# EAGLE design Polysex board (EAGLE 7.6.0)
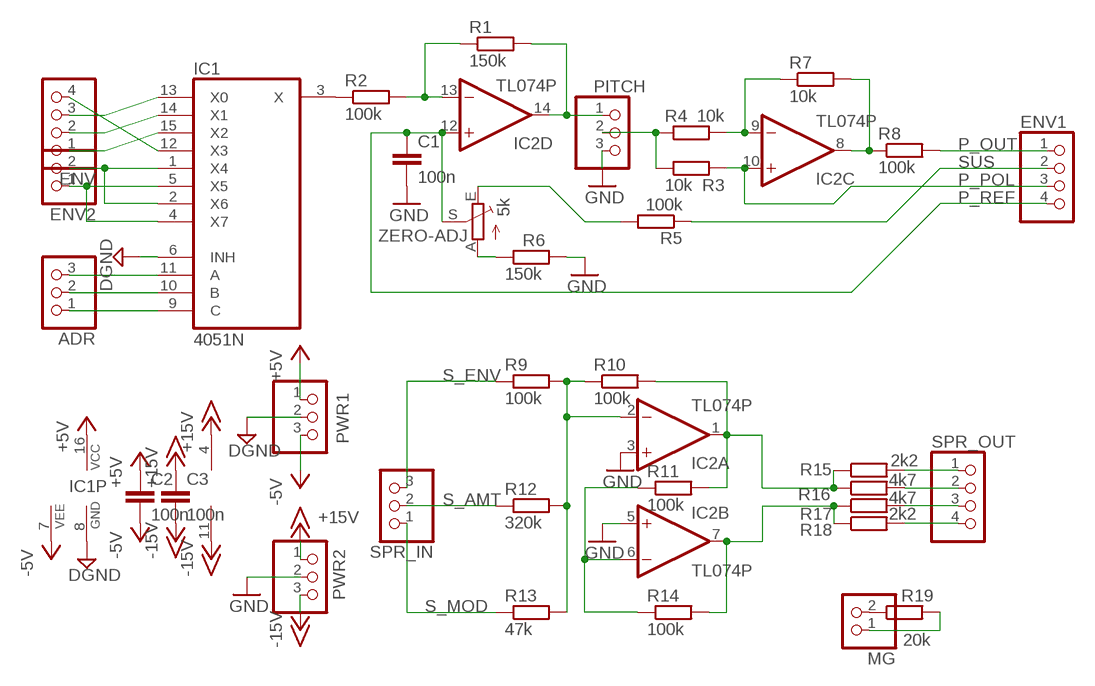
[diagram p0: schematic, sheet 1]

## Parts
ADR  PINHD-1X3  [1X03]
C1  100n  C-EU025-025X050  [C025-025X050]
C2  100n  C-EU025-025X050  [C025-025X050]
C3  100n  C-EU025-025X050  [C025-025X050]
ENV  PINHD-1X4  [1X04]
ENV1  PINHD-1X4  [1X04]
ENV2  PINHD-1X2  [1X02]
IC1  4051N  [DIL16]
IC2  TL074P  [DIL14]
MG  PINHD-1X2  [1X02]
PITCH  PINHD-1X3  [1X03]
PWR1  PINHD-1X3  [1X03]
PWR2  PINHD-1X3  [1X03]
R1  150k  R-EU_0204/7  [0204/7]
R2  100k  R-EU_0204/7  [0204/7]
R3  10k  R-EU_0204/7  [0204/7]
R4  10k  R-EU_0204/7  [0204/7]
R5  100k  R-EU_0204/7  [0204/7]
R6  150k  R-EU_0204/7  [0204/7]
R7  10k  R-EU_0204/7  [0204/7]
R8  100k  R-EU_0204/7  [0204/7]
R9  100k  R-EU_0204/7  [0204/7]
R10  100k  R-EU_0204/7  [0204/7]
R11  100k  R-EU_0204/7  [0204/7]
R12  320k  R-EU_0204/7  [0204/7]
R13  47k  R-EU_0204/7  [0204/7]
R14  100k  R-EU_0204/7  [0204/7]
R15  2k2  R-EU_0204/7  [0204/7]
R16  4k7  R-EU_0204/7  [0204/7]
R17  4k7  R-EU_0204/7  [0204/7]
R18  2k2  R-EU_0204/7  [0204/7]
R19  20k  R-EU_0204/7  [0204/7]
SPR_IN  PINHD-1X3  [1X03]
SPR_OUT  PINHD-1X4  [1X04]
ZERO-ADJ  5k  TRIM_EU-CA6V  [CA6V]

## Nets
+5V: C2.1 IC1.16(VCC) PWR1.1
+15V: C3.1 IC2.4(P:V+) PWR2.1
-5V: C2.2 IC1.7(VEE) PWR1.3
-15V: C3.2 IC2.11(P:V-) PWR2.3
DGND: IC1.6(INH) IC1.8(GND) PWR1.2
GND: C1.2 IC2.3(A:+IN) IC2.5(B:+IN) PITCH.3 PWR2.2 R6.2
N$1: IC1.3(X) R2.1
N$2: IC2.13(D:-IN) R1.1 R2.2
N$3: IC2.14(D:OUT) PITCH.1 R1.2
N$4: R5.2 ZERO-ADJ.E
N$5: MG.2 R19.1
N$6: IC2.9(C:-IN) R4.2 R7.1
N$7: MG.1 R19.2
N$8: PITCH.2 R3.1 R4.1
N$9: IC2.8(C:OUT) R7.2 R8.1
N$11: R6.1 ZERO-ADJ.A
N$12: IC2.2(A:-IN) R9.2 R10.1 R12.2 R13.2
N$13: IC2.1(A:OUT) R10.2 R11.2 R15.1 R16.1
N$16: IC2.6(B:-IN) R11.1 R14.1
N$19: IC2.7(B:OUT) R14.2 R17.1 R18.1
N$20: R15.2 SPR_OUT.1
N$21: R16.2 SPR_OUT.2
N$22: R17.2 SPR_OUT.3
N$23: R18.2 SPR_OUT.4
N$26: ADR.1 IC1.9(C)
N$27: ADR.2 IC1.10(B)
N$28: ADR.3 IC1.11(A)
P_OUT: ENV1.1 R8.2
P_POL: ENV1.3 IC2.10(C:+IN) R3.2
P_REF: C1.1 ENV1.4 IC2.12(D:+IN) ZERO-ADJ.S
S_AMT: R12.1 SPR_IN.2
S_ENV: R9.1 SPR_IN.3
S_MOD: R13.1 SPR_IN.1
SUS: ENV1.2 R5.1
X0: ENV.3 IC1.13(X0)
X1: ENV.2 IC1.14(X1)
X2: ENV.1 IC1.15(X2)
X3: ENV.4 IC1.12(X3)
X4: ENV2.2 IC1.1(X4) IC1.2(X6)
X5: ENV2.1 IC1.4(X7) IC1.5(X5)

## Library data of the parts
ADR PITCH PWR1 PWR2 SPR_IN = pinhead:PINHD-1X3: PIN HEADER
C1-C3 = rcl:C-EU: CAPACITOR, European symbol
ENV ENV1 SPR_OUT = pinhead:PINHD-1X4: PIN HEADER
ENV2 MG = pinhead:PINHD-1X2: PIN HEADER
IC1 = 40xx:4051: 8-channel ANALOG MULTIPLEXER
IC2 = linear:TL074: OP AMP
R1-R19 = rcl:R-EU_: RESISTOR, European symbol
ZERO-ADJ = pot:TRIM_EU-: POTENTIOMETER

## Board
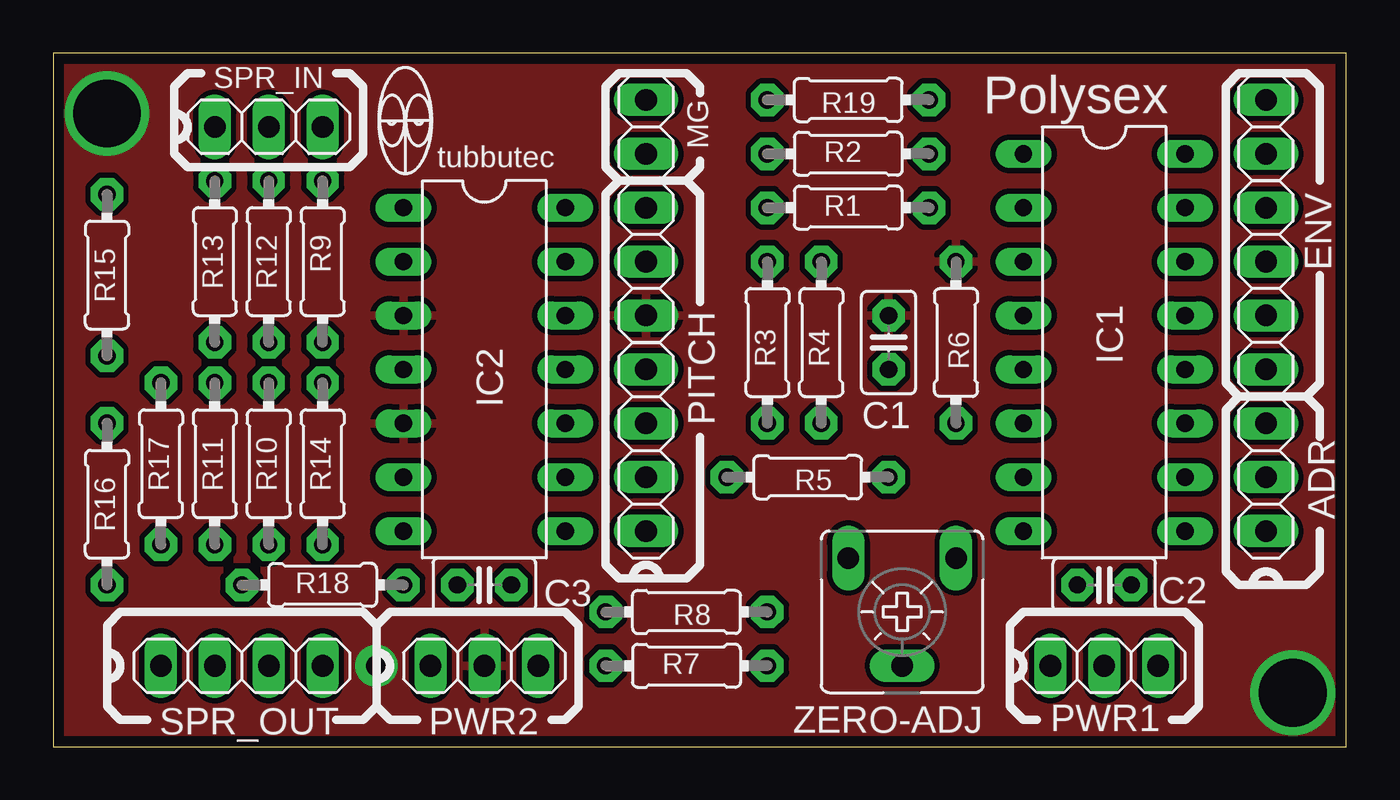
[diagram p1: board, top side]
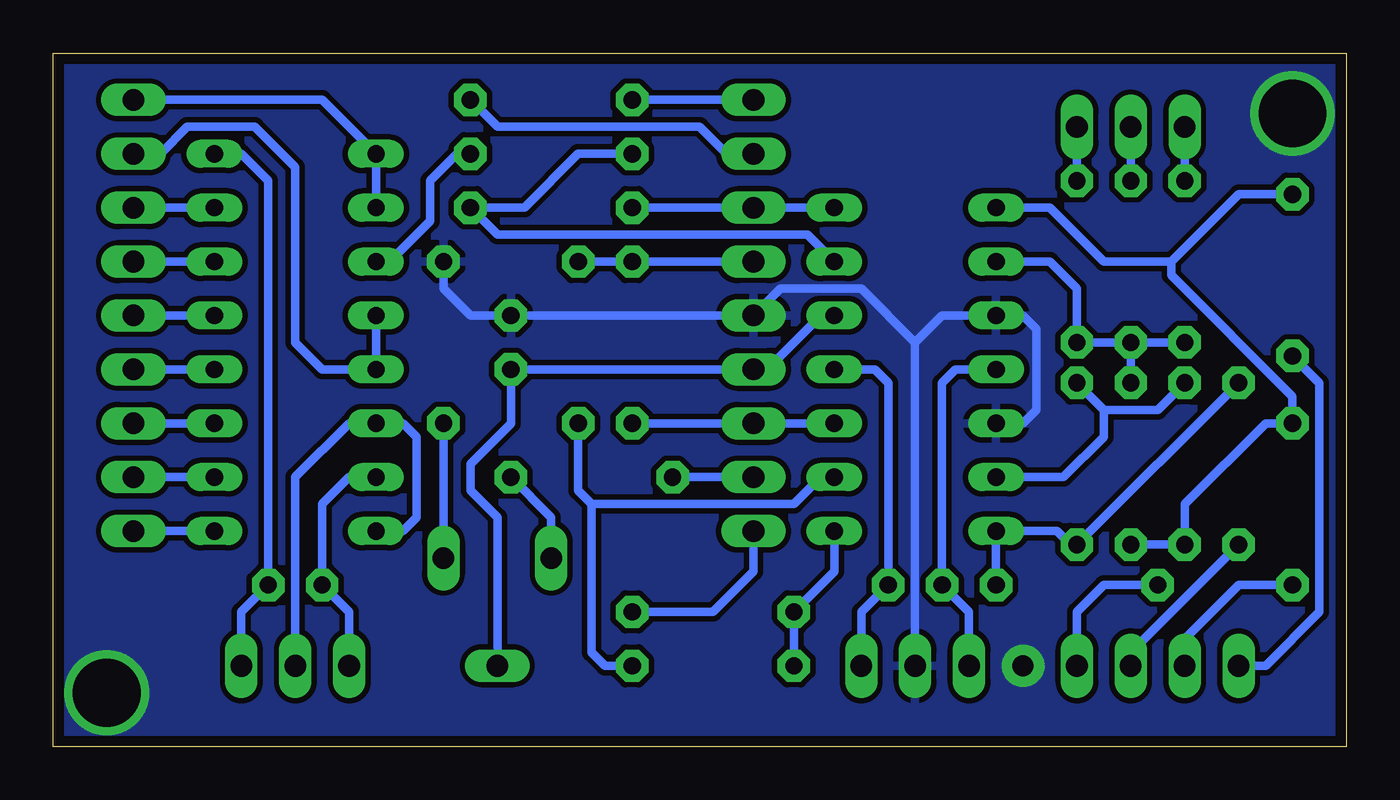
[diagram p2: board, bottom side, seen from below]

Size 60.94 x 32.69 mm. Coordinates in mm from the lower left corner, seen from the top.
Outline: 0,0 60.94,0 60.94,32.69 0,32.69 0,0
Copper layers (1*16): Top 0.035mm / dielectric 1.5mm / Bottom 0.035mm
Design rules "default *": minimum track width 10mil, minimum drill 12mil, track to track 10mil, track to pad 10mil, pad to pad 10mil, via to via 10mil, smd to smd 10mil, copper to edge 20mil, drill to drill 8mil, minimum pad ring 10mil, minimum via ring 10mil, stop-mask expansion 3mil, vias tented up to drill 0mil, thermal gap 10mil

### Footprints (pad centres in the part's own frame; a part is rotated, then mirrored left to right if it is on the bottom)
1X03 = drill 1.016 long: 1 -2.54,0; 2 0,0; 3 2.54,0
C025-025X050 = drill 0.813 pad 1.524 octagon: 1 -1.27,0; 2 1.27,0
1X04 = drill 1.016 long: 1 -3.81,0; 2 -1.27,0; 3 1.27,0; 4 3.81,0
1X02 = drill 1.016 long: 1 -1.27,0; 2 1.27,0
DIL16 = drill 0.813 long: 1 -8.89,-3.81; 2 -6.35,-3.81; 3 -3.81,-3.81; 4 -1.27,-3.81; 5 1.27,-3.81; 6 3.81,-3.81; 7 6.35,-3.81; 8 8.89,-3.81; 9 8.89,3.81; 10 6.35,3.81; 11 3.81,3.81; 12 1.27,3.81; 13 -1.27,3.81; 14 -3.81,3.81; 15 -6.35,3.81; 16 -8.89,3.81
DIL14 = drill 0.813 long: 1 -7.62,-3.81; 2 -5.08,-3.81; 3 -2.54,-3.81; 4 0,-3.81; 5 2.54,-3.81; 6 5.08,-3.81; 7 7.62,-3.81; 8 7.62,3.81; 9 5.08,3.81; 10 2.54,3.81; 11 0,3.81; 12 -2.54,3.81; 13 -5.08,3.81; 14 -7.62,3.81
0204/7 = drill 0.813 pad 1.524 octagon: 1 -3.81,0; 2 3.81,0
CA6V = drill 1.016 long: A -2.54,-2.54; E 2.54,-2.54; S 0,2.54

### Placement (x,y rotation side)
ADR  57.15,12.7 90 top
C1  39.37,19.05 90 top
C2  49.53,7.62 180 top
C3  20.32,7.62 0 top
ENV  57.15,21.59 270 top
ENV1  27.94,13.97 90 top
ENV2  57.15,29.21 90 top
IC1  49.53,19.05 270 top
IC2  20.32,17.78 270 top
MG  27.94,29.21 90 top
PITCH  27.94,22.86 270 top
PWR1  49.53,3.81 180 top
PWR2  20.32,3.81 0 top
R1  37.47,25.4 180 top
R2  37.47,27.94 180 top
R3  33.66,19.05 270 top
R4  36.2,19.05 270 top
R5  35.56,12.7 0 top
R6  42.55,19.05 90 top
R7  29.84,3.81 180 top
R8  29.84,6.35 0 top
R9  12.7,22.86 270 top
R10  10.16,13.34 270 top
R11  7.62,13.34 270 top
R12  10.16,22.86 270 top
R13  7.62,22.86 270 top
R14  12.7,13.34 270 top
R15  2.54,22.23 270 top
R16  2.54,11.43 270 top
R17  5.08,13.34 270 top
R18  12.7,7.62 180 top
R19  37.47,30.48 0 top
SPR_IN  10.16,29.21 0 top
SPR_OUT  8.89,3.81 0 top
ZERO-ADJ  40.01,6.35 180 top

### Tracks (layer width: path | path; a pad name or v marks a point on that pad's centre or on a via)
+5V
  Bottom 0.406: IC1.16 52.07,27.94 50.8,26.67 C2.1 52.07,6.35 PWR1.1
+15V
  Bottom 0.406: 17.78,2.54 PWR2.1 17.78,6.35 C3.1 19.05,17.14 18.41,17.78 IC2.4
-5V
  Bottom 0.406: IC1.7 46.99,12.7 48.26,11.43 C2.2 46.99,6.35 PWR1.3
-15V
  Bottom 0.406: IC2.11 22.23,17.78 21.59,17.14 C3.2 22.86,6.35 PWR2.3
DGND
  Bottom 0.406: PWR1.2 49.53,12.7 46.99,15.24 IC1.6 44.45,15.24 43.81,14.61 43.81,10.79 44.45,10.16 IC1.8
GND  (via drill 1 pad 2, 3.2 pad 4)
  Bottom 0.406: 20.32,2.54 PWR2.2 20.32,19.05 | IC2.5 15.24,15.24 14.61,15.88 14.61,19.68 15.24,20.32 IC2.3 19.05,20.32 20.32,19.05 | 20.32,19.05 22.86,21.59 26.67,21.59 PITCH.3 C1.2 41.27,20.32 42.55,21.59 R6.2
  other vias: 15.24,3.81 2.54,29.84 58.42,2.54
  pour Bottom: 0,33.02 60.96,33.02 60.96,0 0,0
  pour Top: 0,32.38 60.96,32.38 60.96,0 0,0
N$1
  Bottom 0.406: 46.35,22.86 IC1.3 45.09,22.86 43.18,24.77 43.18,26.67 41.91,27.94 R2.1
N$2
  Bottom 0.406: IC2.13 25.4,24.13 40.01,24.13 R1.1 38.73,25.4 36.2,27.94 R2.2
N$3
  Bottom 0.406: IC2.14 PITCH.1 R1.2
N$4
  Bottom 0.406: R5.2 37.47,10.79 ZERO-ADJ.E
N$5
  Bottom 0.406: MG.2 R19.1
N$6
  Bottom 0.406: R4.2 36.2,12.06 35.56,11.43 | 35.56,11.43 35.56,4.45 34.92,3.81 R7.1 | IC2.9 24.77,12.7 26.04,11.43 35.56,11.43
N$7
  Bottom 0.406: R19.2 40.01,29.21 30.48,29.21 29.21,27.94 MG.1
N$8
  Bottom 0.406: PITCH.2 R3.1 R4.1
N$9
  Bottom 0.406: R7.2 R8.1 24.13,8.26 IC2.8
N$11
  Bottom 0.406: ZERO-ADJ.A R6.1
N$12
  Bottom 0.406: R13.2 R12.2 | R12.2 R9.2 12.7,21.59 13.97,22.86 IC2.2 | R10.1 R12.2
N$13
  Bottom 0.406: R10.2 R11.2 7.62,11.43 3.81,15.24 R16.1 2.54,16.51 8.26,22.23 8.26,22.86 | IC2.1 13.97,25.4 11.43,22.86 8.26,22.86 | R15.1 5.08,26.04 8.26,22.86
N$16
  Bottom 0.406: R14.1 11.43,15.88 | 11.43,15.88 8.89,15.88 R11.1 | IC2.6 13.34,12.7 11.43,14.61 11.43,15.88
N$19
  Bottom 0.406: R18.1 IC2.7 13.65,10.16 13.02,9.53 R14.2 R17.1
N$20
  Bottom 0.406: R15.2 1.27,17.14 1.27,6.35 3.81,3.81 SPR_OUT.1
N$21
  Bottom 0.406: 7.62,4.45 SPR_OUT.2 7.62,5.08 5.08,7.62 R16.2
N$22
  Bottom 0.406: R17.2 10.16,4.45 SPR_OUT.3
N$23
  Bottom 0.406: R18.2 11.43,7.62 12.7,6.35 SPR_OUT.4
N$26
  Bottom 0.406: ADR.1 IC1.9
N$27
  Bottom 0.406: IC1.10 ADR.2
N$28
  Bottom 0.406: ADR.3 IC1.11
P_OUT
  Bottom 0.406: ENV1.1 27.94,8.26 29.84,6.35 R8.2
P_POL
  Bottom 0.406: IC2.10 ENV1.3 R3.2
P_REF
  Bottom 0.406: ZERO-ADJ.S 40.01,10.79 41.27,12.06 41.27,13.34 39.37,15.24 C1.1 ENV1.4 27.3,17.78 24.77,20.32 IC2.12
S_AMT
  Bottom 0.406: R12.1 SPR_IN.2
S_ENV
  Bottom 0.406: R9.1 SPR_IN.3
S_MOD
  Bottom 0.406: R13.1 SPR_IN.1
SUS
  Bottom 0.406: ENV1.2 R5.1
X0
  Bottom 0.406: ENV.3 IC1.13
X1
  Bottom 0.406: IC1.14 ENV.2
X2
  Bottom 0.406: ENV.1 IC1.15
X3
  Bottom 0.406: IC1.12 ENV.4
X4
  Bottom 0.406: ENV2.2 48.26,30.48 IC1.1 IC1.2
X5
  Bottom 0.406: ENV2.1 55.88,27.94 54.61,29.21 51.44,29.21 49.53,27.3 49.53,19.05 48.26,17.78 IC1.5 IC1.4

### Text on the board
tNames: Polysex | tubbutec
tDocu: Copyright Tobias Münzer, Tubbutec 2016. / This documentation describes Open Hardware and is licensed under the / CERN OHL v. 1.2. / You may redistribute and modify this file under the terms of the / CERN OHL v.1.2. (http://ohwr.org/cernohl). This file is distributed / WITHOUT ANY EXPRESS OR IMPLIED WARRANTY, INCLUDING OF / MERCHANTABILITY, SATISFACTORY QUALITY AND FITNESS FOR A / PARTICULAR PURPOSE. Please see the CERN OHL v.1.2 for applicable / conditions